# Altium schematic sheet [03] - MCU PWR & UNUSED.SchDoc
size A3; DocumentNumber: 3; SheetNumber: 3; SheetTotal: 18
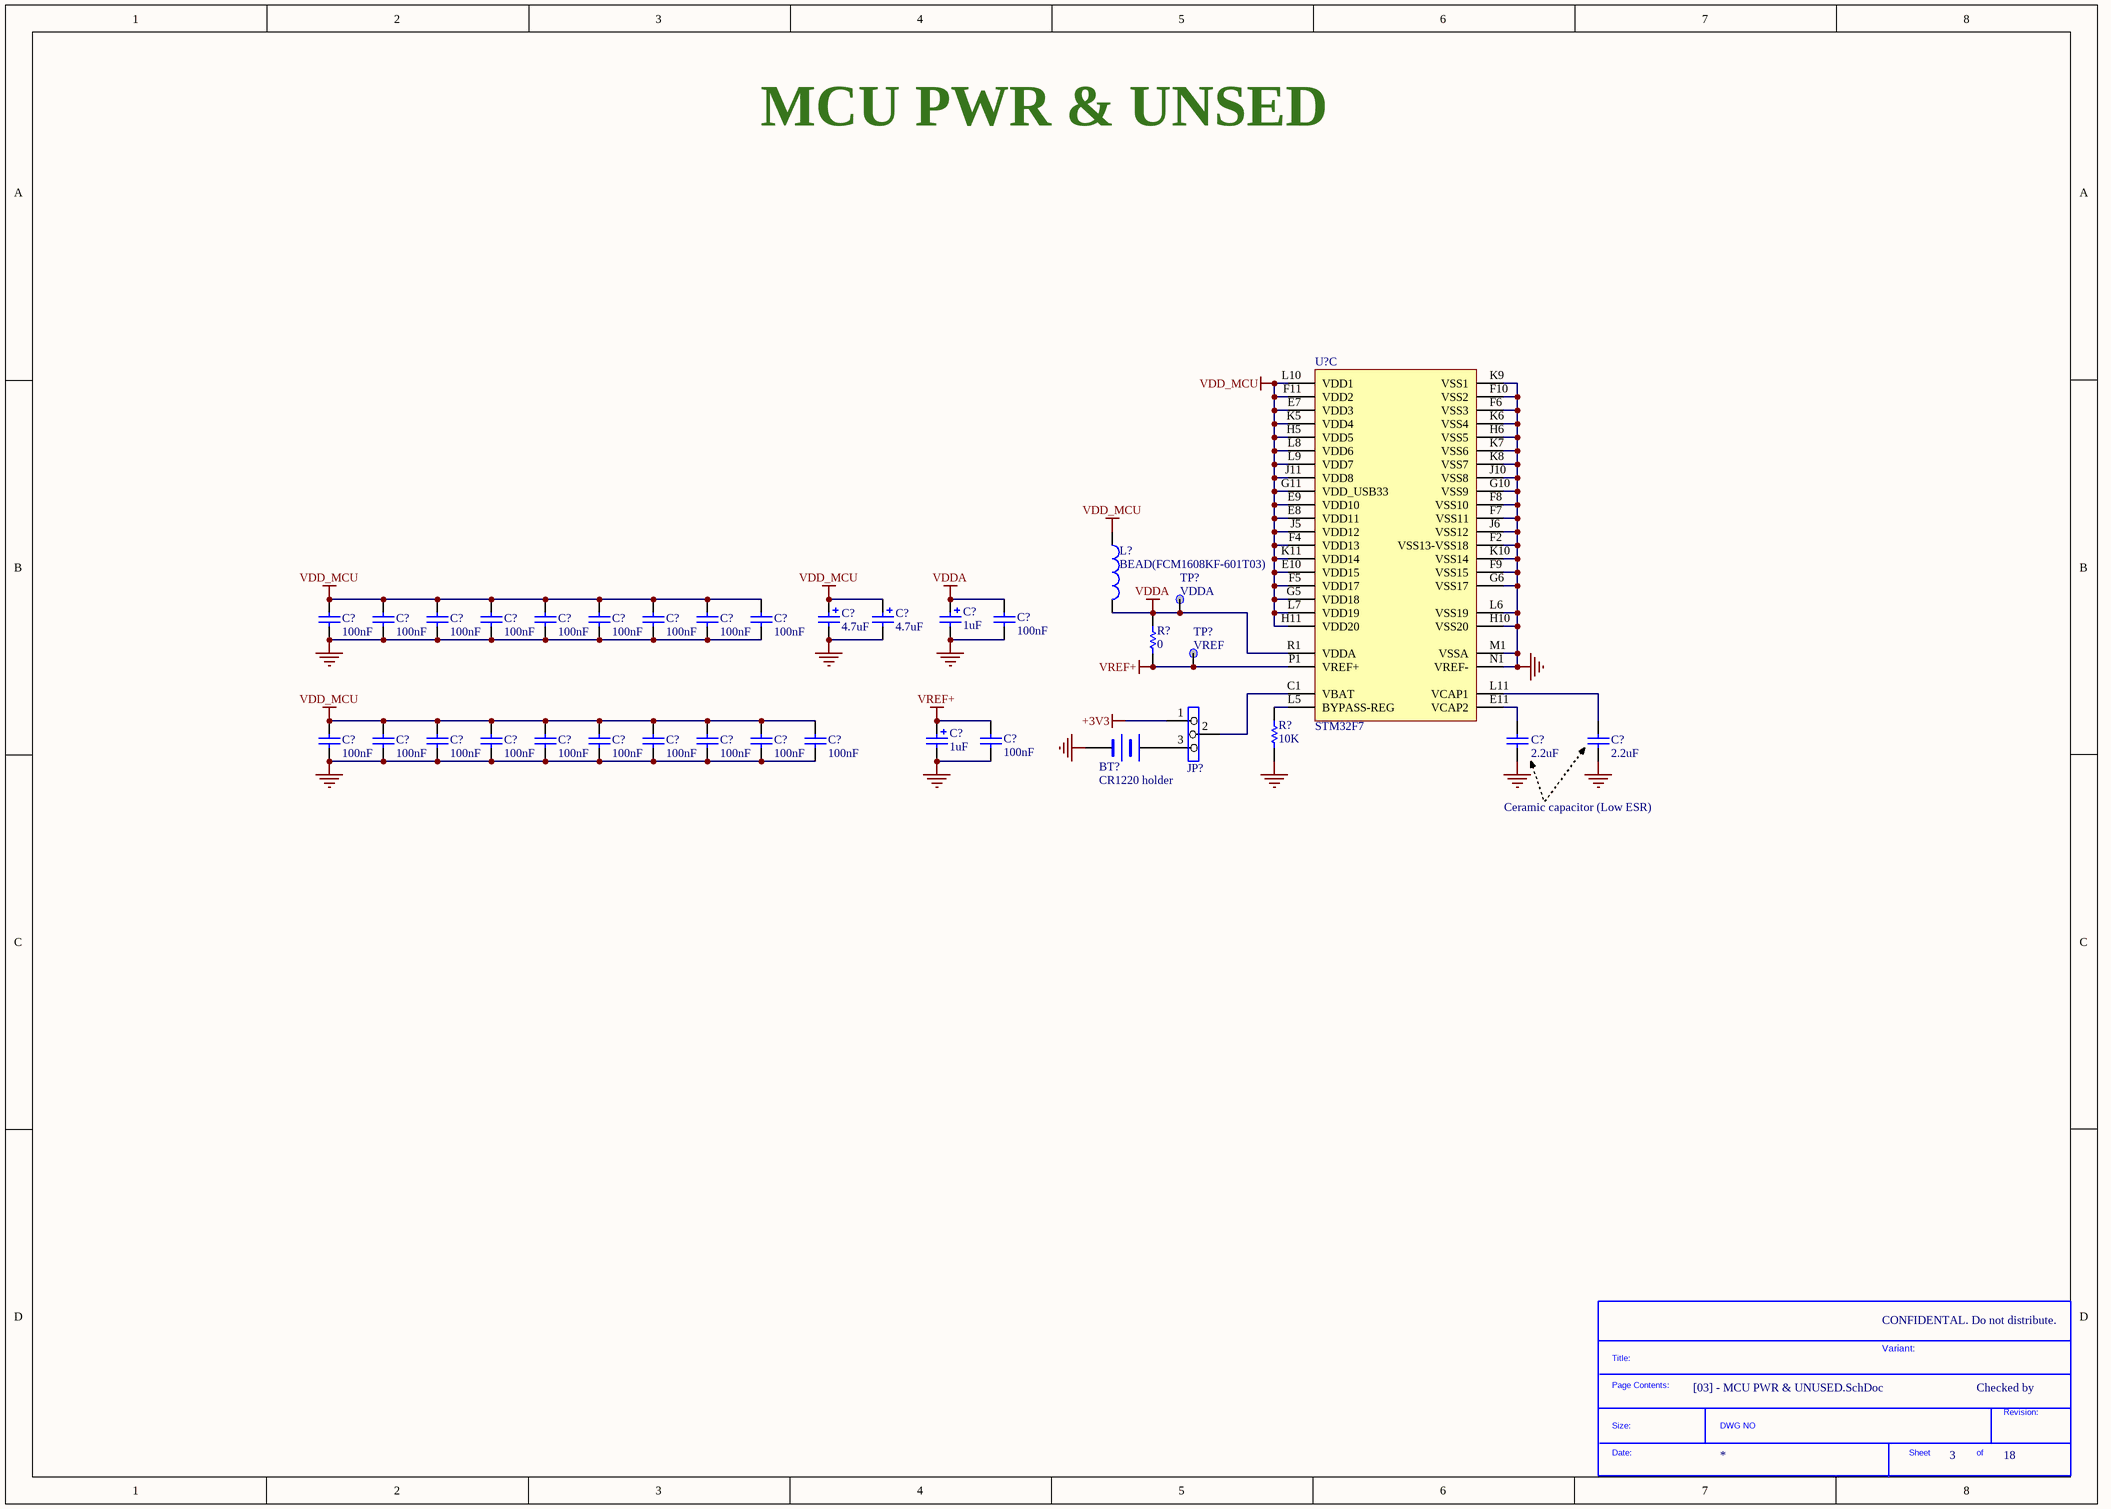
[diagram p0: [03] - MCU PWR & UNUSED.SchDoc]

## Parts
(Parts that share a designator on the sheet are numbered #1, #2 ... from top to bottom, then left to right.)
*  SDTitleBlock  (value not drawn)  (graphical)
BT?  CR1220 holder  [BAT_2SM_CR1220]
C?#1  100nF  [0402C]
C?#2  100nF  [0402C]
C?#3  100nF  [0402C]
C?#4  100nF  [0402C]
C?#5  100nF  [0402C]
C?#6  100nF  [0402C]
C?#7  100nF  [0402C]
C?#8  100nF  [0402C]
C?#9  100nF  [0402C]
C?#10  4.7uF  [TAN-A]
C?#11  4.7uF  [TAN-A]
C?#12  1uF  [TAN-A]
C?#13  100nF  [0402C]
C?#14  100nF  [0402C]
C?#15  100nF  [0402C]
C?#16  100nF  [0402C]
C?#17  100nF  [0402C]
C?#18  100nF  [0402C]
C?#19  100nF  [0402C]
C?#20  100nF  [0402C]
C?#21  100nF  [0402C]
C?#22  100nF  [0402C]
C?#23  100nF  [0402C]
C?#24  1uF  [TAN-A]
C?#25  2.2uF  [1206C]
C?#26  2.2uF  [1206C]
C?#27  100nF  [0402C]
JP?  (no value)  [SIP3]
L?  BEAD(FCM1608KF-601T03)  [0603L]
R?#1  0  [0603R]
R?#2  10K  [0603R]
TP?#1  VDDA  [TP]
TP?#2  VREF  [TP]
U?  STM32F7  [BGA216_0R8_13X13_SKT]  (part C of 3)

## Nets
+3V3: JP?.1
GND: BT?.2(-) C?#1.2 C?#2.2 C?#3.2 C?#4.2 C?#5.2 C?#6.2 C?#7.2 C?#8.2 C?#9.2 C?#10.2 C?#11.2 C?#12.2 C?#13.1 C?#14.2 C?#15.2 C?#16.2 C?#17.2 C?#18.2 C?#19.2 C?#20.2 C?#21.2 C?#22.2 C?#23.2 C?#24.2 C?#25.2 C?#26.2 C?#27.1 R?#2.1 U?.F2(VSS13-VSS18) U?.F6(VSS3) U?.F7(VSS11) U?.F8(VSS10) U?.F9(VSS15) U?.F10(VSS2) U?.G6(VSS17) U?.G10(VSS9) U?.H6(VSS5) U?.H10(VSS20) U?.J6(VSS12) U?.J10(VSS8) U?.K6(VSS4) U?.K7(VSS6) U?.K8(VSS7) U?.K9(VSS1) U?.K10(VSS14) U?.L6(VSS19) U?.M1(VSSA) U?.N1(VREF-)
VDD_MCU: C?#1.1 C?#2.1 C?#3.1 C?#4.1 C?#5.1 C?#6.1 C?#7.1 C?#8.1 C?#9.1 C?#10.1 C?#11.1 C?#14.1 C?#15.1 C?#16.1 C?#17.1 C?#18.1 C?#19.1 C?#20.1 C?#21.1 C?#22.1 C?#23.1 L?.1 U?.E7(VDD3) U?.E8(VDD11) U?.E9(VDD10) U?.E10(VDD15) U?.F4(VDD13) U?.F5(VDD17) U?.F11(VDD2) U?.G5(VDD18) U?.G11(VDD_USB33) U?.H5(VDD5) U?.H11(VDD20) U?.J5(VDD12) U?.J11(VDD8) U?.K5(VDD4) U?.K11(VDD14) U?.L7(VDD19) U?.L8(VDD6) U?.L9(VDD7) U?.L10(VDD1)
VDDA: C?#12.1 C?#13.2 L?.2 R?#1.1 TP?#1.1 U?.R1(VDDA)
VREF+: C?#24.1 C?#27.2 R?#1.2 TP?#2.1 U?.P1(VREF+)
NetBT?_1: BT?.1(+) JP?.3
NetC?#25_1: C?#25.1 U?.E11(VCAP2)
NetC?#26_1: C?#26.1 U?.L11(VCAP1)
NetJP?_2: JP?.2 U?.C1(VBAT)
NetR?#2_2: R?#2.2 U?.L5(BYPASS-REG)

## Notes on the sheet
- MCU PWR & UNSED
- Ceramic capacitor (Low ESR)
- CONFIDENTAL. Do not distribute.
- CLOCKS (CPU & PCIE)
- Variant:
- Checked by
- (in symbol SDTitleBlock) Title:; Page Contents:; Revision:; Size:; DWG NO; Date:; Sheet; of

## Library data of the parts
BT? = BATTERY
C?#1-C?#9 C?#14-C?#23 = CAP: Capacitor; Published: 8-Jun-2000; Revision: July-2002: Re-released for DXP Platform.; Publisher: Altium Limited; Value: 100nF
C?#10 C?#11 = Cap Pol1: Polarized Capacitor (Radial); Value: 47uF; Published: 8-Jun-2000; Revision: July-2002: Re-released for DXP Platform.; Publisher: Altium Limited
C?#12 C?#24 = Cap Pol1: Polarized Capacitor (Radial); Value: 10uF; Published: 8-Jun-2000; Revision: July-2002: Re-released for DXP Platform.; Publisher: Altium Limited
C?#13 C?#25-C?#27 = Cap: Capacitor; Value: 10nF; Published: 8-Jun-2000; Revision: July-2002: Re-released for DXP Platform.; Publisher: Altium Limited
JP? = Jumper3
L? = Inductor: Value: 100uH; Published: 8-Jun-2000; Revision: July-2002: Re-released for DXP Platform.; Publisher: Altium Limited
R?#1 R?#2 = Res1: Resistor; Value: 1K; Published: 8-Jun-2000; Revision: July-2002: Re-released for DXP Platform.; Publisher: Altium Limited
TP?#1 TP?#2 = TP
U? = STM32F7_TFBGA216